# Altium schematic sheet [7]RFID_OLED.SchDoc
size A4
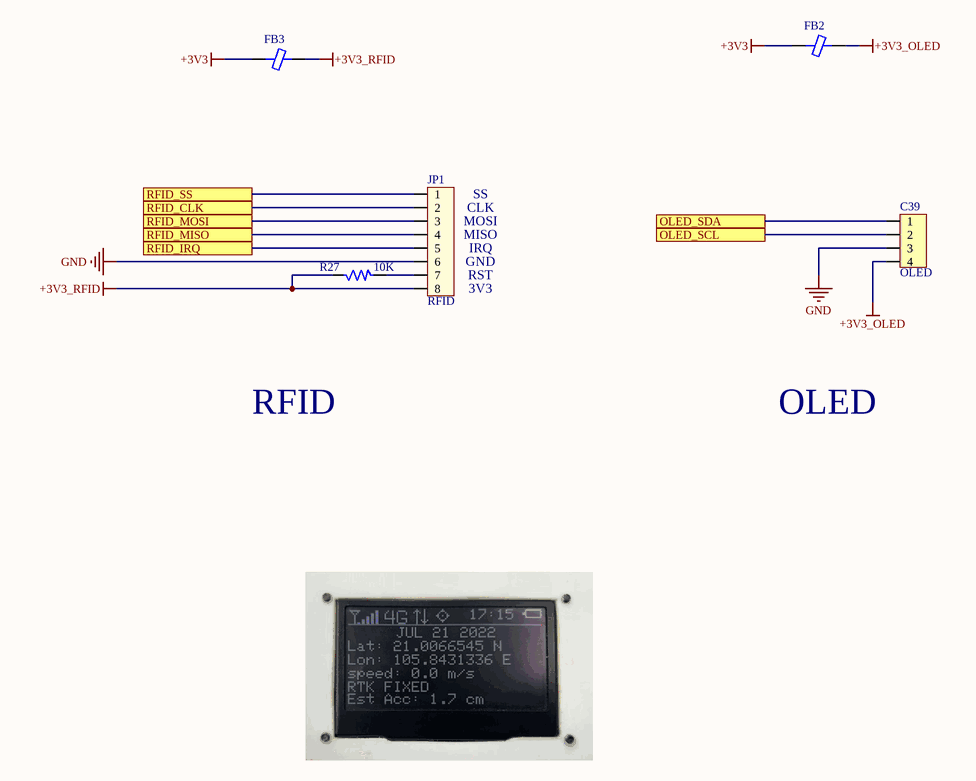
[diagram p0: [7]RFID_OLED.SchDoc]

## Parts
C39  OLED  [CON_4P]
FB2  120R  [RES-SMD-0805]  (value not drawn)
FB3  120R  [RES-SMD-0805]  (value not drawn)
JP1  RFID  [CON_8P]
R27  10K  [R0805]

## Ports
OLED_SCL, OLED_SDA, RFID_CLK, RFID_IRQ, RFID_MISO, RFID_MOSI, RFID_SS

## Nets
+3V3: FB2.1 FB3.1
+3V3_OLED: C39.4 FB2.2
+3V3_RFID: FB3.2 JP1.8 R27.1
GND: C39.3 JP1.6
OLED_SCL: C39.2 ; port OLED_SCL
OLED_SDA: C39.1 ; port OLED_SDA
RFID_CLK: JP1.2 ; port RFID_CLK
RFID_IRQ: JP1.5 ; port RFID_IRQ
RFID_MISO: JP1.4 ; port RFID_MISO
RFID_MOSI: JP1.3 ; port RFID_MOSI
RFID_SS: JP1.1 ; port RFID_SS
NetJP1_7: JP1.7 R27.2

## Notes on the sheet
- (near JP1) SS
- (near JP1) CLK
- (near JP1) MOSI
- (near JP1) MISO
- (near JP1) IRQ
- (near JP1) GND
- (near JP1) RST
- (near JP1) 3V3
- RFID
- OLED
- Title
- Size:
- Date:
- A4
- Number:
- Time:
- Revision:
- Sheet
- of
- File:

## Library data of the parts
C39 = Header4: Header IDC, 4 x 1 Pin Vertical 2.54mm Pitch (Non-Boxed, Male); Manufacturer: W¨¹rth Elektronik eiSos GmbH; partNo: 613002143121; ComponentLink1 Description: Manufacturer; ComponentLink2 Description: Datasheet; NoPins: 02; Created Date: 29 March 2013; ComponentLink1URL: http://www.we-online.com; ComponentLink2URL: http://katalog.we-online.de/em/datasheet/6130xx143121.pdf; Created by: Karrer Zheng
FB2 FB3 = Ferrite beads
JP1 = Con8: Connector 8; Value: Connector 8
R27 = RM: Resistor SMD; Value: 1K